# EAGLE design keypad (EAGLE 6.1)
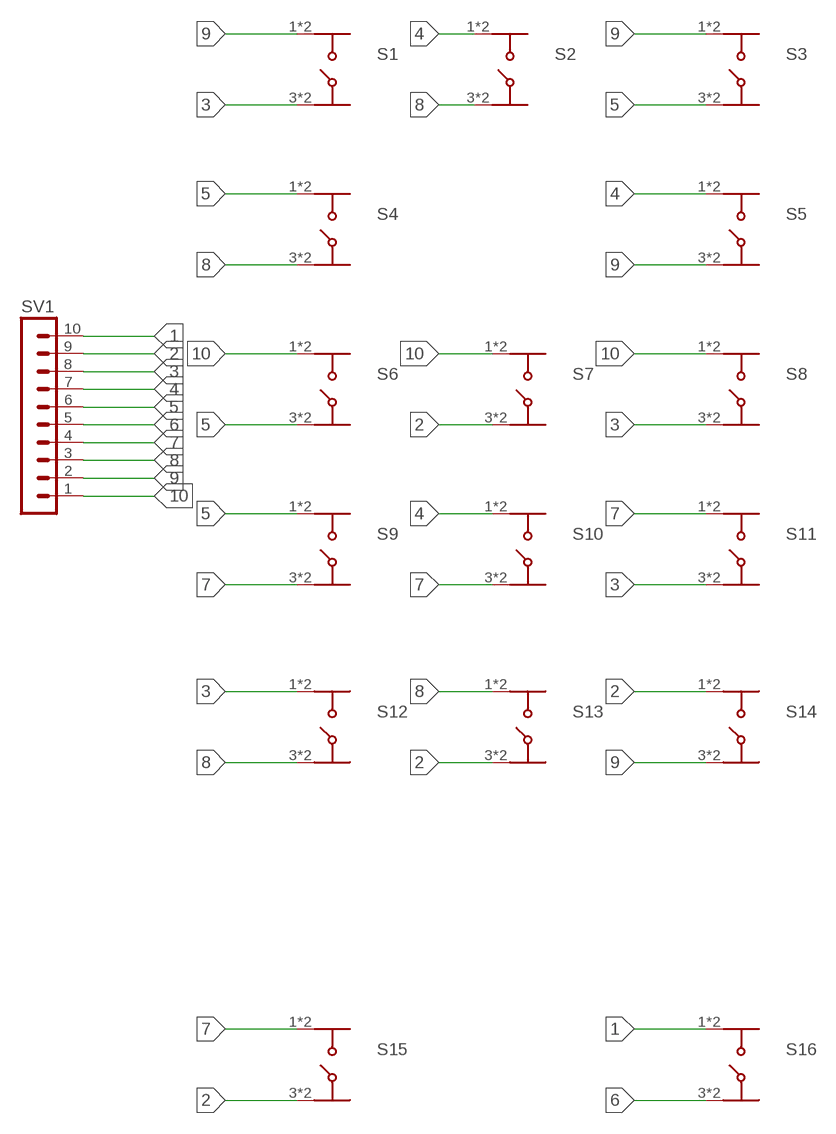
[diagram p0: schematic, sheet 1]

## Parts
S1  430481025816  [430481025816]
S2  430481025816  [430481025816]
S3  430481025816  [430481025816]
S4  430481025816  [430481025816]
S5  430481025816  [430481025816]
S6  430481025816  [430481025816]
S7  430481025816  [430481025816]
S8  430481025816  [430481025816]
S9  430481025816  [430481025816]
S10  430481025816  [430481025816]
S11  430481025816  [430481025816]
S12  430481025816  [430481025816]
S13  430481025816  [430481025816]
S14  430481025816  [430481025816]
S15  430481025816  [430481025816]
S16  430481025816  [430481025816]
SV1  MA10-1  [MA10-1]

## Nets
1: S16.1(A) S16.2(A) SV1.10
2: S7.3(B) S7.4(B) S13.3(B) S13.4(B) S14.1(A) S14.2(A) S15.3(B) S15.4(B) SV1.9
3: S1.3(B) S1.4(B) S8.3(B) S8.4(B) S11.3(B) S11.4(B) S12.1(A) S12.2(A) SV1.8
4: S2.1(A) S2.2(A) S5.1(A) S5.2(A) S10.1(A) S10.2(A) SV1.7
5: S3.3(B) S3.4(B) S4.1(A) S4.2(A) S6.3(B) S6.4(B) S9.1(A) S9.2(A) SV1.6
6: S16.3(B) S16.4(B) SV1.5
7: S9.3(B) S9.4(B) S10.3(B) S10.4(B) S11.1(A) S11.2(A) S15.1(A) S15.2(A) SV1.4
8: S2.3(B) S2.4(B) S4.3(B) S4.4(B) S12.3(B) S12.4(B) S13.1(A) S13.2(A) SV1.3
9: S1.1(A) S1.2(A) S3.1(A) S3.2(A) S5.3(B) S5.4(B) S14.3(B) S14.4(B) SV1.2
10: S6.1(A) S6.2(A) S7.1(A) S7.2(A) S8.1(A) S8.2(A) SV1.1

## Library data of the parts
S1-S16 = EAGLE-TACT_SWITCHES-rev16e:430481025816: 6x6 mm SMD washable WS-TASV <http://katalog.we-online.de/media/images/v2/Family_WS-TASV_SMD_Tact_Switch_6x6mm_4304810xx8xx.jpg> Details see: http://katalog.we-online.de/em/datasheet/4304x1xxx8x6.pdf 2015 (C) Wurth Elektronik
SV1 = con-lstb:MA10-1: PIN HEADER; OC_FARNELL: unknown; OC_NEWARK: unknown

## Board
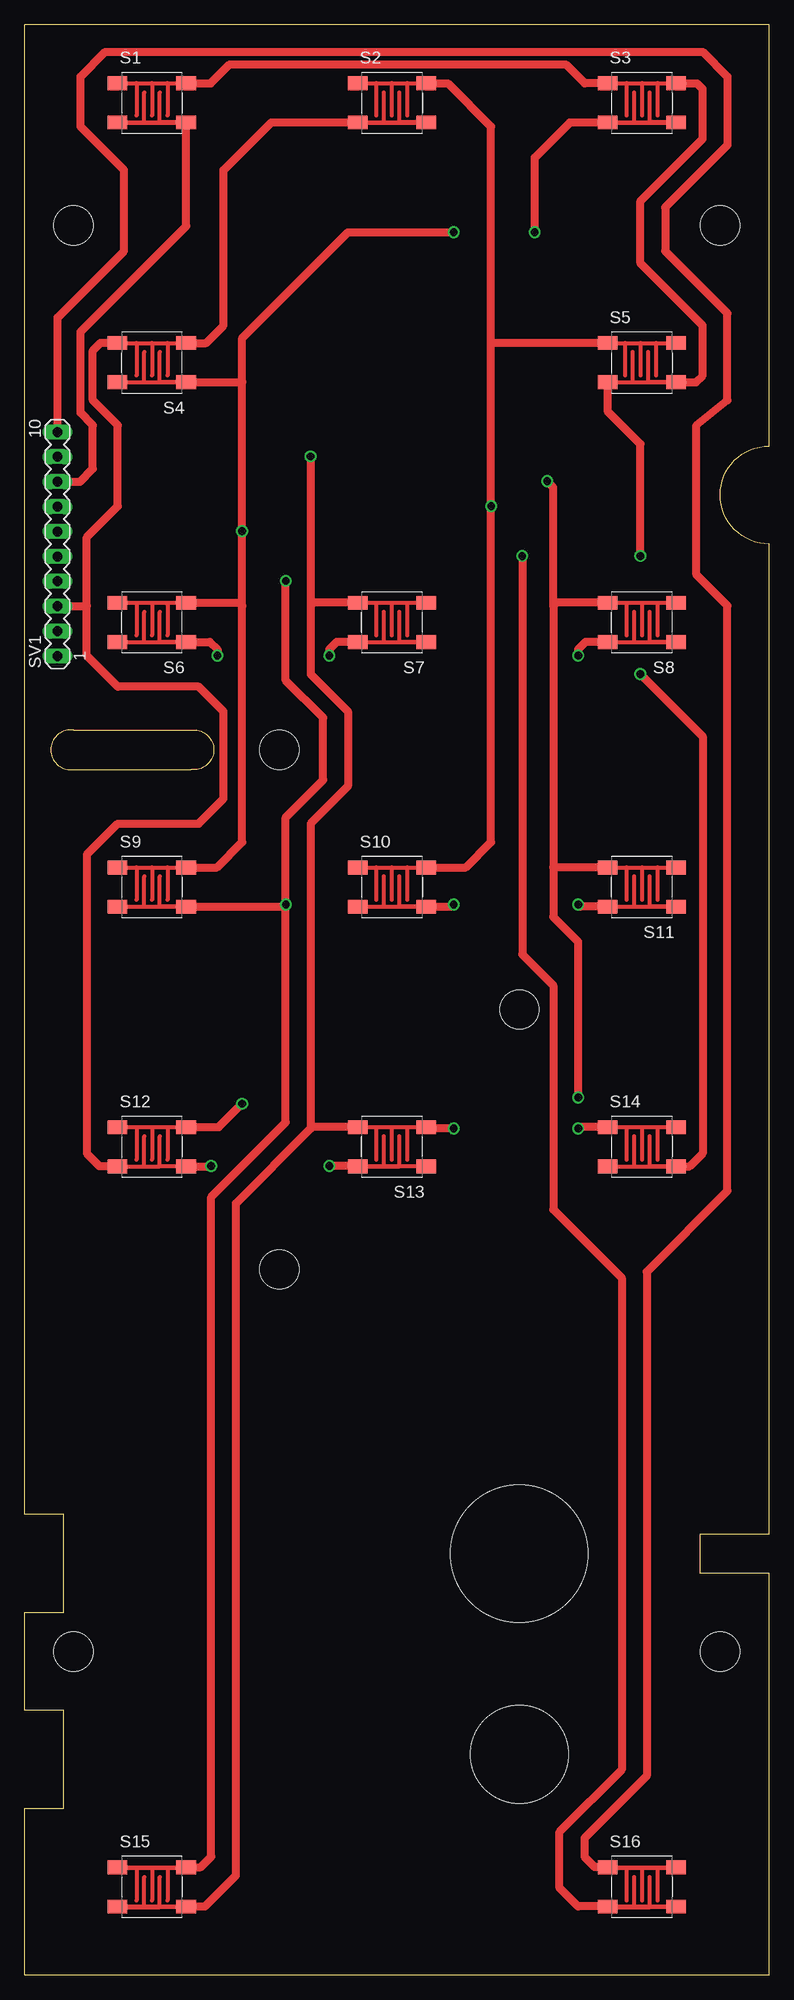
[diagram p1: board, top side]
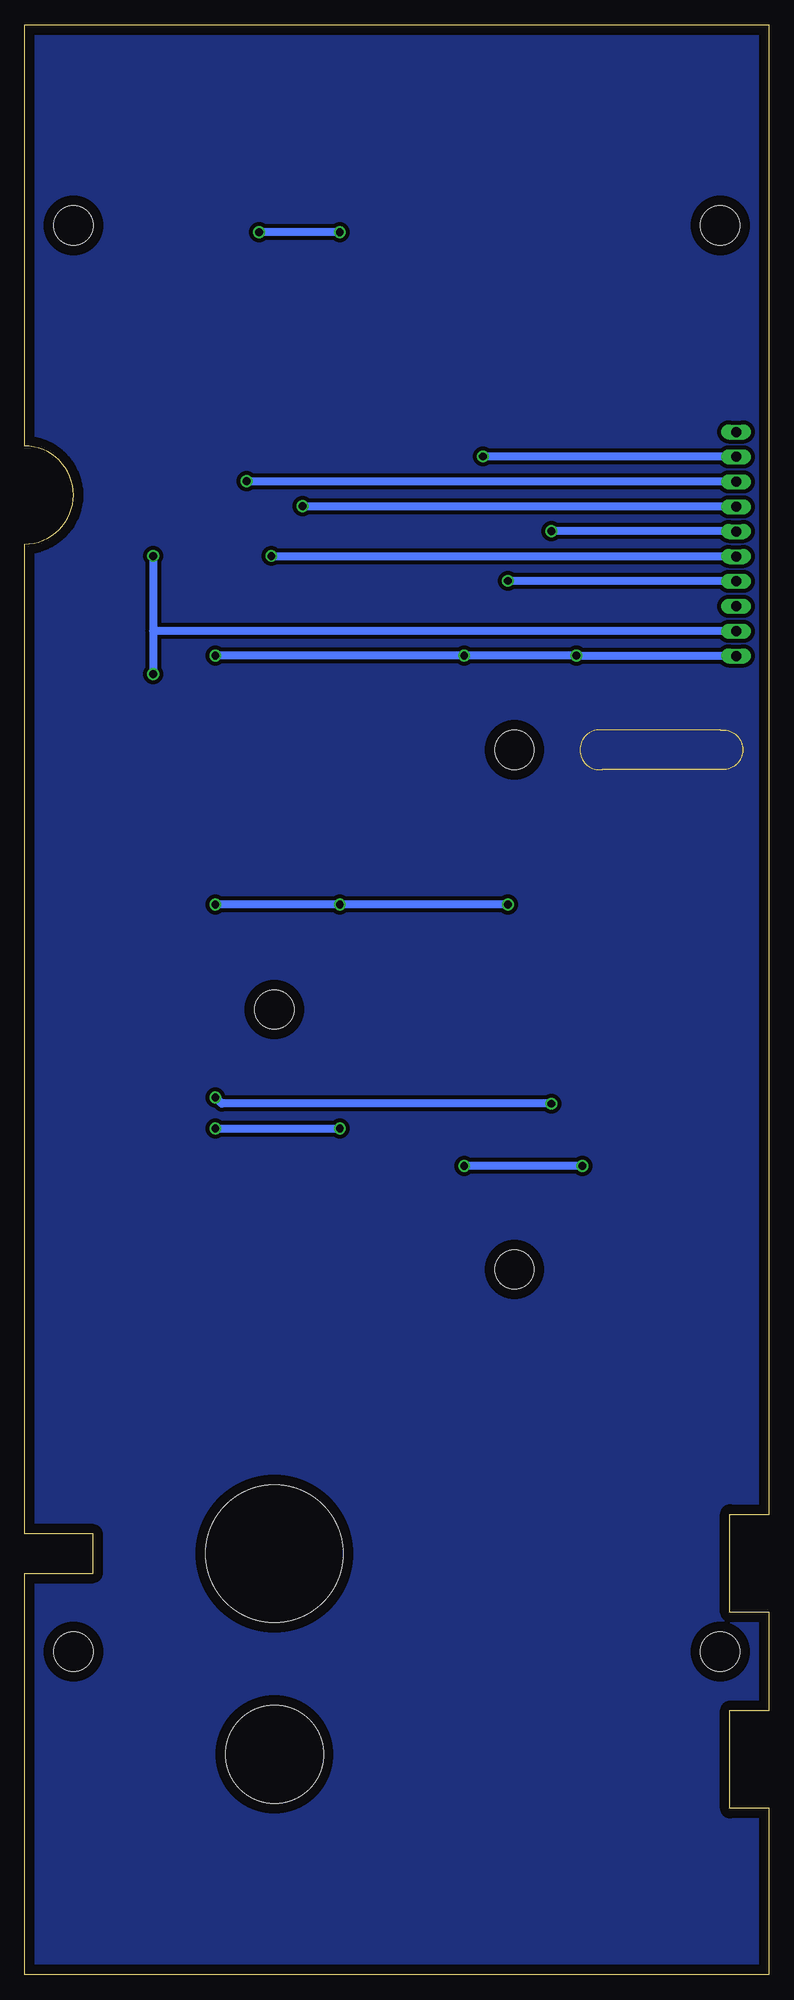
[diagram p2: board, bottom side, seen from below]

Size 76 x 199 mm. Coordinates in mm from the lower left corner, seen from the top.
Outline: 0,0 76,0 76,41 69,41 69,45 76,45 76,146 arc-180 76,156 76,199 0,199 0,47 4,47 4,37 0,37 0,27 4,27 4,17 0,17 0,0
Copper layers (1*16): Top 0.035mm / dielectric 1.5mm / Bottom 0.035mm
Design rules: minimum track width 10mil, minimum drill 24mil, track to track 8mil, track to pad 8mil, pad to pad 8mil, via to via 8mil, smd to smd 8mil, copper to edge 40mil, drill to drill 8mil, minimum pad ring 10mil, minimum via ring 8mil, stop-mask expansion 4mil, vias tented up to drill 0mil, thermal gap 10mil
Holes 10 mm at 50.5,22.5
Holes 14 mm at 50.5,43
Holes 4 mm at 5,33 71,33 26,72 50.5,98.5 71,178.5 5,178.5 26,125
Milling: 4 lines

### Footprints (pad centres in the part's own frame; a part is rotated, then mirrored left to right if it is on the bottom)
430481025816 = smd 2 x 1.4: 1 -3.5,2; 2 3.5,2; 3 -3.5,-2; 4 3.5,-2
MA10-1 = drill 1.016 long: 1 -11.43,0; 2 -8.89,0; 3 -6.35,0; 4 -3.81,0; 5 -1.27,0; 6 1.27,0; 7 3.81,0; 8 6.35,0; 9 8.89,0; 10 11.43,0

### Placement (x,y rotation side)
S1  13,191 0 top
S2  37.5,191 0 top
S3  63,191 0 top
S4  13,164.5 180 top
S5  63,164.5 0 top
S6  13,138 180 top
S7  37.5,138 180 top
S8  63,138 180 top
S9  13,111 0 top
S10  37.5,111 0 top
S11  63,111 180 top
S12  13,84.5 0 top
S13  37.5,84.5 180 top
S14  63,84.5 0 top
S15  13,9 0 top
S16  63,9 0 top
SV1  3.37,146 90 top

### Tracks (layer width: path | path; a pad name or v marks a point on that pad's centre or on a via)
1
  Top 0.406: S16.1 S16.2
  Top 0.813: SV1.10 3.37,169.1 10.16,175.9 10.16,184.15 5.71,188.59 5.71,193.68 8.26,196.22 69.22,196.22 71.75,193.68 71.75,186.69 65.41,180.34 65.41,175.9 71.75,169.54 71.75,160.66 68.58,158.12 68.58,142.88 71.75,139.7 71.75,80.01 63.5,71.75 63.5,20.32 57.15,13.97 57.15,12.06 58.22,11 S16.1
2  (via drill 0.8)
  Top 0.406: S15.3 S15.4 | S15.4 16.51,6.99 16.5,6.99 S15.4 | 34.43,86.5 S13.3 | S14.1 S14.2 | S7.4 S7.3
  Top 0.813: S15.4 18.43,7 21.59,10.16 21.59,78.74 29.21,86.36 | 34.43,86.5 34.29,86.36 34.15,86.5 S13.4 29.35,86.5 29.21,86.36 | v29.21,154.94 29.21,139.7 | S14.1 56.66,86.5 v56.52,86.36 | v43.81,86.36 41.14,86.36 S13.3 | S7.4 29.51,140 29.21,139.7 | 29.21,139.7 29.21,132.72 33.02,128.91 33.02,121.28 29.21,117.47 29.21,86.36
  Bottom 0.813: SV1.9 29.16,154.89 v29.21,154.94 | v56.52,86.36 v43.81,86.36
3  (via drill 0.8)
  Top 0.406: 11.43,86.5 11.43,83.19 | 16.37,86.5 16.19,86.5 | 14.61,86.5 14.61,83.19 | 13.02,86.5 13.02,83.19 | 9.66,86.5 11.43,86.5 | 14.61,86.5 16.19,86.5 | 16.19,86.5 16.19,86.52 | 11.43,86.5 13.02,86.5 | 13.02,86.5 14.61,86.5 | 59.72,113 S11.3 | S8.4 S8.3 | S1.3 S1.4 16.51,189.23
  Top 0.813: 53.98,139.7 53.98,151.76 v53.34,152.4 | S8.4 54.27,140 53.98,139.7 | 53.98,139.7 53.98,113.03 | 53.98,113.03 53.98,107.95 56.52,105.41 v56.52,89.53 | 16.51,86.36 16.37,86.5 S12.2 19.82,86.5 v22.23,88.9 | 9.66,86.5 9.53,86.36 9.5,86.39 S12.1 | 53.98,113.03 54.01,113 S11.4 59.53,113.03 59.69,113.03 59.72,113 | S1.4 16.51,188.59 16.51,178.44 5.71,167.64 5.71,159.38 6.99,158.12 6.99,153.67 5.67,152.35 SV1.8
  Bottom 0.813: v22.23,88.9 55.88,88.9 v56.52,89.53 | SV1.8 53.29,152.35 v53.34,152.4
4  (via drill 0.8)
  Top 0.406: S10.1 S10.2 | S5.1 S5.2 | S2.1 S2.2
  Top 0.813: S2.2 43.22,193 47.62,188.59 47.62,166.37 | S10.2 45.05,113 47.62,115.57 v47.62,149.86 47.62,166.37 | S5.1 47.76,166.5 47.62,166.37
  Bottom 0.813: v47.62,149.86 3.31,149.86 | 3.17,149.86 3.31,149.86 | 3.31,149.86 SV1.7
5  (via drill 0.8)
  Top 0.406: S9.1 S9.2 | S6.4 16.21,140 | S4.2 S4.1 | S3.3 S3.4
  Top 0.813: S9.2 19.66,113 22.23,115.57 22.23,139.7 | 22.23,139.7 v22.23,147.32 22.23,162.56 | 16.51,140.02 16.21,140 S6.3 21.93,140 22.23,139.7 | S4.1 22.16,162.5 22.23,162.56 | 22.23,162.56 22.23,167 33.02,177.8 v43.81,177.8 | v52.07,177.8 52.07,185.42 55.65,189 S3.3
  Bottom 0.813: v43.81,177.8 v52.07,177.8 | SV1.6 3.44,147.27 4.76,147.32 v22.23,147.32
6  (via drill 0.8)
  Top 0.406: S16.3 S16.4
  Top 0.813: v50.8,144.78 50.8,104.14 53.98,100.97 53.98,78.11 60.96,71.12 60.96,20.95 54.61,14.61 54.61,8.89 56.5,7 S16.3
  Bottom 0.813: SV1.5 50.75,144.73 v50.8,144.78
7  (via drill 0.8)
  Top 0.406: S15.1 S15.2 | S9.3 S9.4 | S10.3 S10.4 | S11.2 S11.1
  Top 0.813: S11.2 56.73,109 v56.52,109.22 | S10.4 43.59,109 v43.81,109.22 | S15.2 17.98,11 19.05,12.06 19.05,79.38 26.67,87 v26.67,109.22 | S9.4 26.45,109 v26.67,109.22 | v26.67,109.22 26.67,118.11 30.48,121.92 30.48,128.27 26.67,132.08 v26.67,142.24
  Bottom 0.813: v26.67,109.22 v43.81,109.22 v56.52,109.22 | SV1.4 26.62,142.19 v26.67,142.24
8  (via drill 0.8)
  Top 0.406: S12.3 12.22,82.5 | 12.22,82.5 12.22,85.57 | S12.4 13.81,82.5 | 13.81,82.5 13.81,85.57 | 12.22,82.5 13.81,82.5 | 34.29,82.55 41,82.55 S13.1 | S4.4 S4.3 | S2.3 S2.4
  Top 0.813: 41.05,82.55 S13.1 | S13.2 34.24,82.5 34.29,82.55 v31.11,82.55 | S12.4 19,82.5 v19.05,82.55 | 6.35,139.7 6.35,134.62 9.53,131.44 17.78,131.44 20.32,128.91 20.32,120.02 17.78,117.47 9.53,117.47 6.35,114.3 6.35,83.82 7.67,82.5 S12.3 | 6.35,139.7 6.35,146.69 9.53,149.86 9.53,158.12 6.99,160.66 6.99,165.74 7.75,166.5 S4.4 | SV1.3 6.3,139.65 6.35,139.7 | S4.3 18.55,166.5 20.32,168.28 20.32,184.15 25.17,189 S2.3
  Bottom 0.813: v19.05,82.55 v31.11,82.55
9  (via drill 0.8)
  Top 0.406: S14.3 S14.4 | S1.1 S1.2 | S3.1 S3.2 | S5.3 S5.4
  Top 0.813: S1.2 19.01,193 20.95,194.94 55.24,194.94 57.19,193 S3.1 | S5.4 68.52,162.5 69.22,163.19 69.22,168.28 62.87,174.62 62.87,180.97 69.22,187.32 69.22,192.41 68.62,193 S3.2 | v62.87,132.72 69.22,126.36 69.22,83.82 67.89,82.5 S14.4 | v62.87,144.78 62.87,156.21 59.5,159.57 S5.3
  Bottom 0.813: SV1.2 62.81,137.11 | 62.81,137.11 62.87,137.16 | v62.87,144.78 62.87,137.16 | 62.87,137.11 v62.87,132.72 | 62.81,137.11 62.87,137.11 | 62.87,137.11 62.87,137.16
10  (via drill 0.8)
  Top 0.406: S6.2 S6.1 | S7.2 S7.1 | S8.2 S8.1
  Top 0.813: v56.52,134.62 56.52,135.25 57.26,136 S8.2 | S6.1 18.94,136 19.68,135.25 v19.68,134.62 | S7.2 31.86,136 31.11,135.25 v31.11,134.62 | S8.1 66.67,136 66.67,135.89 66.5,135.89 S8.1
  Bottom 0.813: 56.47,134.57 v56.52,134.62 v31.11,134.62 v19.68,134.62 3.42,134.62 SV1.1
13
  Top 0.406: 35.88,86.5 35.88,83.19 | 39.05,83.19 39.05,86.36 39.05,86.5 | 37.47,86.5 37.47,83.19 | 34.11,86.5 35.88,86.5 | 39.05,86.5 40.64,86.5 | 35.88,86.5 37.47,86.5 | 37.47,86.5 39.05,86.5
14
  Top 0.406: 34.11,82.5 36.67,82.5 | 36.67,82.5 36.67,85.57 | 40.63,82.5 38.26,82.5 | 38.26,82.5 38.26,85.57 | 36.67,82.5 38.26,82.5
15
  Top 0.406: 61.44,86.5 61.44,83.19 | 64.61,83.19 64.61,86.36 64.61,86.5 | 63.02,86.5 63.02,83.19 | 59.67,86.5 61.44,86.5 | 64.61,86.5 66.2,86.5 | 61.44,86.5 63.02,86.5 | 63.02,86.5 64.61,86.5
16
  Top 0.406: 59.66,82.5 62.23,82.5 | 62.23,82.5 62.23,85.57 | 66.19,82.5 63.82,82.5 | 63.82,82.5 63.82,85.57 | 62.23,82.5 63.82,82.5
17
  Top 0.406: 11.43,113.01 11.43,109.7 | 14.61,109.7 14.61,112.87 14.61,113.01 | 13.02,113.01 13.02,109.7 | 9.66,113.01 11.43,113.01 | 14.61,113.01 16.19,113.01 | 11.43,113.01 13.02,113.01 | 13.02,113.01 14.61,113.01
18
  Top 0.406: 9.66,109.01 12.22,109.01 | 12.22,109.01 12.22,112.08 | 16.18,109.01 13.81,109.01 | 13.81,109.01 13.81,112.08 | 12.22,109.01 13.81,109.01
19
  Top 0.406: 35.88,113.01 35.88,109.7 | 39.05,109.7 39.05,112.87 39.05,113.01 | 37.47,113.01 37.47,109.7 | 34.11,113.01 35.88,113.01 | 39.05,113.01 40.64,113.01 | 35.88,113.01 37.47,113.01 | 37.47,113.01 39.05,113.01
20
  Top 0.406: 34.11,109.01 36.67,109.01 | 36.67,109.01 36.67,112.08 | 40.63,109.01 38.26,109.01 | 38.26,109.01 38.26,112.08 | 36.67,109.01 38.26,109.01
21
  Top 0.406: 61.44,113.01 61.44,109.7 | 64.61,109.7 64.61,112.87 64.61,113.01 | 63.02,113.01 63.02,109.7 | 59.67,113.01 61.44,113.01 | 64.61,113.01 66.2,113.01 | 61.44,113.01 63.02,113.01 | 63.02,113.01 64.61,113.01
22
  Top 0.406: 59.66,109.01 62.23,109.01 | 62.23,109.01 62.23,112.08 | 66.19,109.01 63.82,109.01 | 63.82,109.01 63.82,112.08 | 62.23,109.01 63.82,109.01
23
  Top 0.406: 11.43,140 11.43,136.68 | 14.61,136.68 14.61,139.86 14.61,140 | 13.02,140 13.02,136.68 | 9.66,140 11.43,140 | 14.61,140 16.19,140 | 11.43,140 13.02,140 | 13.02,140 14.61,140
24
  Top 0.406: 9.66,136 12.22,136 | 12.22,136 12.22,139.06 | 16.18,136 13.81,136 | 13.81,136 13.81,139.06 | 12.22,136 13.81,136
25
  Top 0.406: 35.88,140 35.88,136.68 | 39.05,136.68 39.05,139.86 39.05,140 | 37.47,140 37.47,136.68 | 34.11,140 35.88,140 | 39.05,140 40.64,140 | 35.88,140 37.47,140 | 37.47,140 39.05,140
26
  Top 0.406: 34.11,136 36.67,136 | 36.67,136 36.67,139.06 | 40.63,136 38.26,136 | 38.26,136 38.26,139.06 | 36.67,136 38.26,136
29
  Top 0.406: 61.28,166.51 61.28,163.19 | 64.45,163.19 64.45,166.37 64.45,166.51 | 62.87,166.51 62.87,163.19 | 59.51,166.51 61.28,166.51 | 64.45,166.51 66.04,166.51 | 61.28,166.51 62.87,166.51 | 62.87,166.51 64.45,166.51
30
  Top 0.406: 59.51,162.51 62.07,162.51 | 62.07,162.51 62.07,165.58 | 66.03,162.51 63.66,162.51 | 63.66,162.51 63.66,165.58 | 62.07,162.51 63.66,162.51
31
  Top 0.406: 11.43,193.02 11.43,189.71 | 14.61,189.71 14.61,192.88 14.61,193.02 | 13.02,193.02 13.02,189.71 | 9.66,193.02 11.43,193.02 | 14.61,193.02 16.19,193.02 | 11.43,193.02 13.02,193.02 | 13.02,193.02 14.61,193.02
32
  Top 0.406: 9.66,189.02 12.22,189.02 | 12.22,189.02 12.22,192.09 | 16.18,189.02 13.81,189.02 | 13.81,189.02 13.81,192.09 | 12.22,189.02 13.81,189.02
33
  Top 0.406: 35.88,193.02 35.88,189.71 | 39.05,189.71 39.05,192.88 39.05,193.02 | 37.47,193.02 37.47,189.71 | 34.11,193.02 35.88,193.02 | 39.05,193.02 40.64,193.02 | 35.88,193.02 37.47,193.02 | 37.47,193.02 39.05,193.02
34
  Top 0.406: 34.11,189.02 36.67,189.02 | 36.67,189.02 36.67,192.09 | 40.63,189.02 38.26,189.02 | 38.26,189.02 38.26,192.09 | 36.67,189.02 38.26,189.02
35
  Top 0.406: 61.44,193.02 61.44,189.71 | 64.61,189.71 64.61,192.88 64.61,193.02 | 63.02,193.02 63.02,189.71 | 59.67,193.02 61.44,193.02 | 64.61,193.02 66.2,193.02 | 61.44,193.02 63.02,193.02 | 63.02,193.02 64.61,193.02
36
  Top 0.406: 59.66,189.02 62.23,189.02 | 62.23,189.02 62.23,192.09 | 66.19,189.02 63.82,189.02 | 63.82,189.02 63.82,192.09 | 62.23,189.02 63.82,189.02
37
  Top 0.406: 11.43,10.94 11.43,7.62 | 14.61,7.62 14.61,10.79 14.61,10.94 | 13.02,10.94 13.02,7.62 | 9.66,10.94 11.43,10.94 | 14.61,10.94 16.19,10.94 | 11.43,10.94 13.02,10.94 | 13.02,10.94 14.61,10.94
38
  Top 0.406: 9.66,6.93 12.22,6.93 | 12.22,6.93 12.22,10 | 16.18,6.93 13.81,6.93 | 13.81,6.93 13.81,10 | 12.22,6.93 13.81,6.93
39
  Top 0.406: 61.44,10.94 61.44,7.62 | 64.61,7.62 64.61,10.79 64.61,10.94 | 63.02,10.94 63.02,7.62 | 59.67,10.94 61.44,10.94 | 64.61,10.94 66.2,10.94 | 61.44,10.94 63.02,10.94 | 63.02,10.94 64.61,10.94
40
  Top 0.406: 59.66,6.93 62.23,6.93 | 62.23,6.93 62.23,10 | 66.19,6.93 63.82,6.93 | 63.82,6.93 63.82,10 | 62.23,6.93 63.82,6.93
41
  Top 0.406: 11.43,166.51 11.43,163.19 | 14.61,163.19 14.61,166.37 14.61,166.51 | 13.02,166.51 13.02,163.19 | 9.66,166.51 11.43,166.51 | 14.61,166.51 16.19,166.51 | 11.43,166.51 13.02,166.51 | 13.02,166.51 14.61,166.51
42
  Top 0.406: 9.66,162.51 12.22,162.51 | 12.22,162.51 12.22,165.58 | 16.18,162.51 13.81,162.51 | 13.81,162.51 13.81,165.58 | 12.22,162.51 13.81,162.51
43
  Top 0.406: 61.44,140 61.44,136.68 | 64.61,136.68 64.61,139.86 64.61,140 | 63.02,140 63.02,136.68 | 59.67,140 61.44,140 | 64.61,140 66.2,140 | 61.44,140 63.02,140 | 63.02,140 64.61,140
44
  Top 0.406: 59.66,136 62.23,136 | 62.23,136 62.23,139.06 | 66.19,136 63.82,136 | 63.82,136 63.82,139.06 | 62.23,136 63.82,136
GND
  pour Bottom (isolate 0.406): 76,199 0,199 0,47 4,47 4,37 0,37 0,27 0,27 3.81,27 3.81,17.14 4,17 0,17 0,0 76.2,0 76.2,40.64 69.22,40.64 69.22,45.09 76,45 76,145.63 71.12,147.96 71.12,153.67 76,156.27